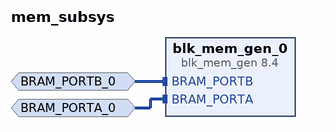
[diagram p0: block diagram of the top level]
# Vivado block design mem_subsys, xczu7ev-ffvc1156-2-e, Vivado 2019.2
create_bd_design mem_subsys

create_bd_intf_port -mode Slave -vlnv xilinx.com:interface:bram_rtl:1.0 BRAM_PORTA_0
create_bd_intf_port -mode Slave -vlnv xilinx.com:interface:bram_rtl:1.0 BRAM_PORTB_0

create_bd_cell -type ip -vlnv xilinx.com:ip:blk_mem_gen:8.4 blk_mem_gen_0
set_property -dict [list \
  CONFIG.Assume_Synchronous_Clk true \
  CONFIG.Collision_Warnings NONE \
  CONFIG.Enable_32bit_Address false \
  CONFIG.Enable_A Always_Enabled \
  CONFIG.Enable_B Always_Enabled \
  CONFIG.Memory_Type True_Dual_Port_RAM \
  CONFIG.Operating_Mode_A NO_CHANGE \
  CONFIG.Operating_Mode_B NO_CHANGE \
  CONFIG.Port_B_Clock 100 \
  CONFIG.Port_B_Enable_Rate 100 \
  CONFIG.Port_B_Write_Rate 50 \
  CONFIG.Read_Width_A 36 \
  CONFIG.Read_Width_B 36 \
  CONFIG.Register_PortA_Output_of_Memory_Primitives false \
  CONFIG.Register_PortB_Output_of_Memory_Primitives false \
  CONFIG.Use_Byte_Write_Enable false \
  CONFIG.Use_RSTA_Pin false \
  CONFIG.Write_Depth_A 1024 \
  CONFIG.Write_Width_A 36 \
  CONFIG.Write_Width_B 36 \
  CONFIG.use_bram_block Stand_Alone \
] [get_bd_cells blk_mem_gen_0]

# ---- connections ----

connect_bd_intf_net -intf_net BRAM_PORTB_0_1 [get_bd_intf_ports BRAM_PORTB_0] [get_bd_intf_pins blk_mem_gen_0/BRAM_PORTB]
connect_bd_intf_net -intf_net BRAM_PORTA_0_1 [get_bd_intf_ports BRAM_PORTA_0] [get_bd_intf_pins blk_mem_gen_0/BRAM_PORTA]

validate_bd_design
save_bd_design
